# Altium schematic sheet SDRAM.SchDoc
size A; SheetNumber: 2; SheetTotal: 4
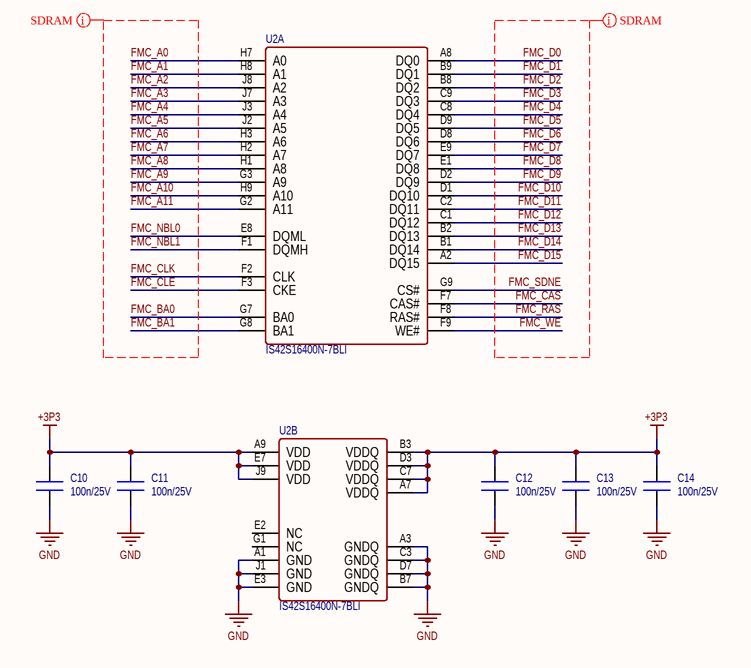
[diagram p0: SDRAM.SchDoc]

## Parts
C10  100n/25V  [CN-SMD-0603]
C11  100n/25V  [CN-SMD-0603]
C12  100n/25V  [CN-SMD-0603]
C13  100n/25V  [CN-SMD-0603]
C14  100n/25V  [CN-SMD-0603]
U2  IS42S16400N-7BLI  [BGA54C80P9X6_800X800X120]  (parts A,B of 2)

## Nets
+3P3: C10.2 C11.2 C12.2 C13.2 C14.2 U2.A7(VDDQ) U2.A9(VDD) U2.B3(VDDQ) U2.C7(VDDQ) U2.D3(VDDQ) U2.E7(VDD) U2.J9(VDD)
GND: C10.1 C11.1 C12.1 C13.1 C14.1 U2.A1(GND) U2.A3(GNDQ) U2.B7(GNDQ) U2.C3(GNDQ) U2.D7(GNDQ) U2.E3(GND) U2.J1(GND)
FMC_A0: U2.H7(A0)
FMC_A1: U2.H8(A1)
FMC_A2: U2.J8(A2)
FMC_A3: U2.J7(A3)
FMC_A4: U2.J3(A4)
FMC_A5: U2.J2(A5)
FMC_A6: U2.H3(A6)
FMC_A7: U2.H2(A7)
FMC_A8: U2.H1(A8)
FMC_A9: U2.G3(A9)
FMC_A10: U2.H9(A10)
FMC_A11: U2.G2(A11)
FMC_BA0: U2.G7(BA0)
FMC_BA1: U2.G8(BA1)
FMC_CAS: U2.F7(CAS#)
FMC_CLE: U2.F3(CKE)
FMC_CLK: U2.F2(CLK)
FMC_D0: U2.A8(DQ0)
FMC_D1: U2.B9(DQ1)
FMC_D2: U2.B8(DQ2)
FMC_D3: U2.C9(DQ3)
FMC_D4: U2.C8(DQ4)
FMC_D5: U2.D9(DQ5)
FMC_D6: U2.D8(DQ6)
FMC_D7: U2.E9(DQ7)
FMC_D8: U2.E1(DQ8)
FMC_D9: U2.D2(DQ9)
FMC_D10: U2.D1(DQ10)
FMC_D11: U2.C2(DQ11)
FMC_D12: U2.C1(DQ12)
FMC_D13: U2.B2(DQ13)
FMC_D14: U2.B1(DQ14)
FMC_D15: U2.A2(DQ15)
FMC_NBL0: U2.E8(DQML)
FMC_NBL1: U2.F1(DQMH)
FMC_RAS: U2.F8(RAS#)
FMC_SDNE: U2.G9(CS#)
FMC_WE: U2.F9(WE#)

Not connected (* = marked no-connect by the designer): U2 E2(NC) G1(NC)

## Layout directives
net class SDRAM: FMC_A0, FMC_A1, FMC_A2, FMC_A3, FMC_A4, FMC_A5, FMC_A6, FMC_A7, FMC_A8, FMC_A9, FMC_A10, FMC_A11, FMC_BA0, FMC_BA1, FMC_CAS, FMC_CLE, FMC_CLK, FMC_D0, FMC_D1, FMC_D2, FMC_D3, FMC_D4, FMC_D5, FMC_D6, FMC_D7, FMC_D8, FMC_D9, FMC_D10, FMC_D11, FMC_D12, FMC_D13, FMC_D14, FMC_D15, FMC_NBL0, FMC_NBL1, FMC_RAS, FMC_SDNE, FMC_WE

## Library data of the parts
C10-C14 = CN: CL10B104KA8NNNC; Value: 33pF
U2 = IS42S16400N-7BLI: 1 Meg Bits x 16 Bits x 4 Banks (64-MBIT) SYNCHRONOUS DYNAMIC RAM; PN: IS42S16400N-7BLI